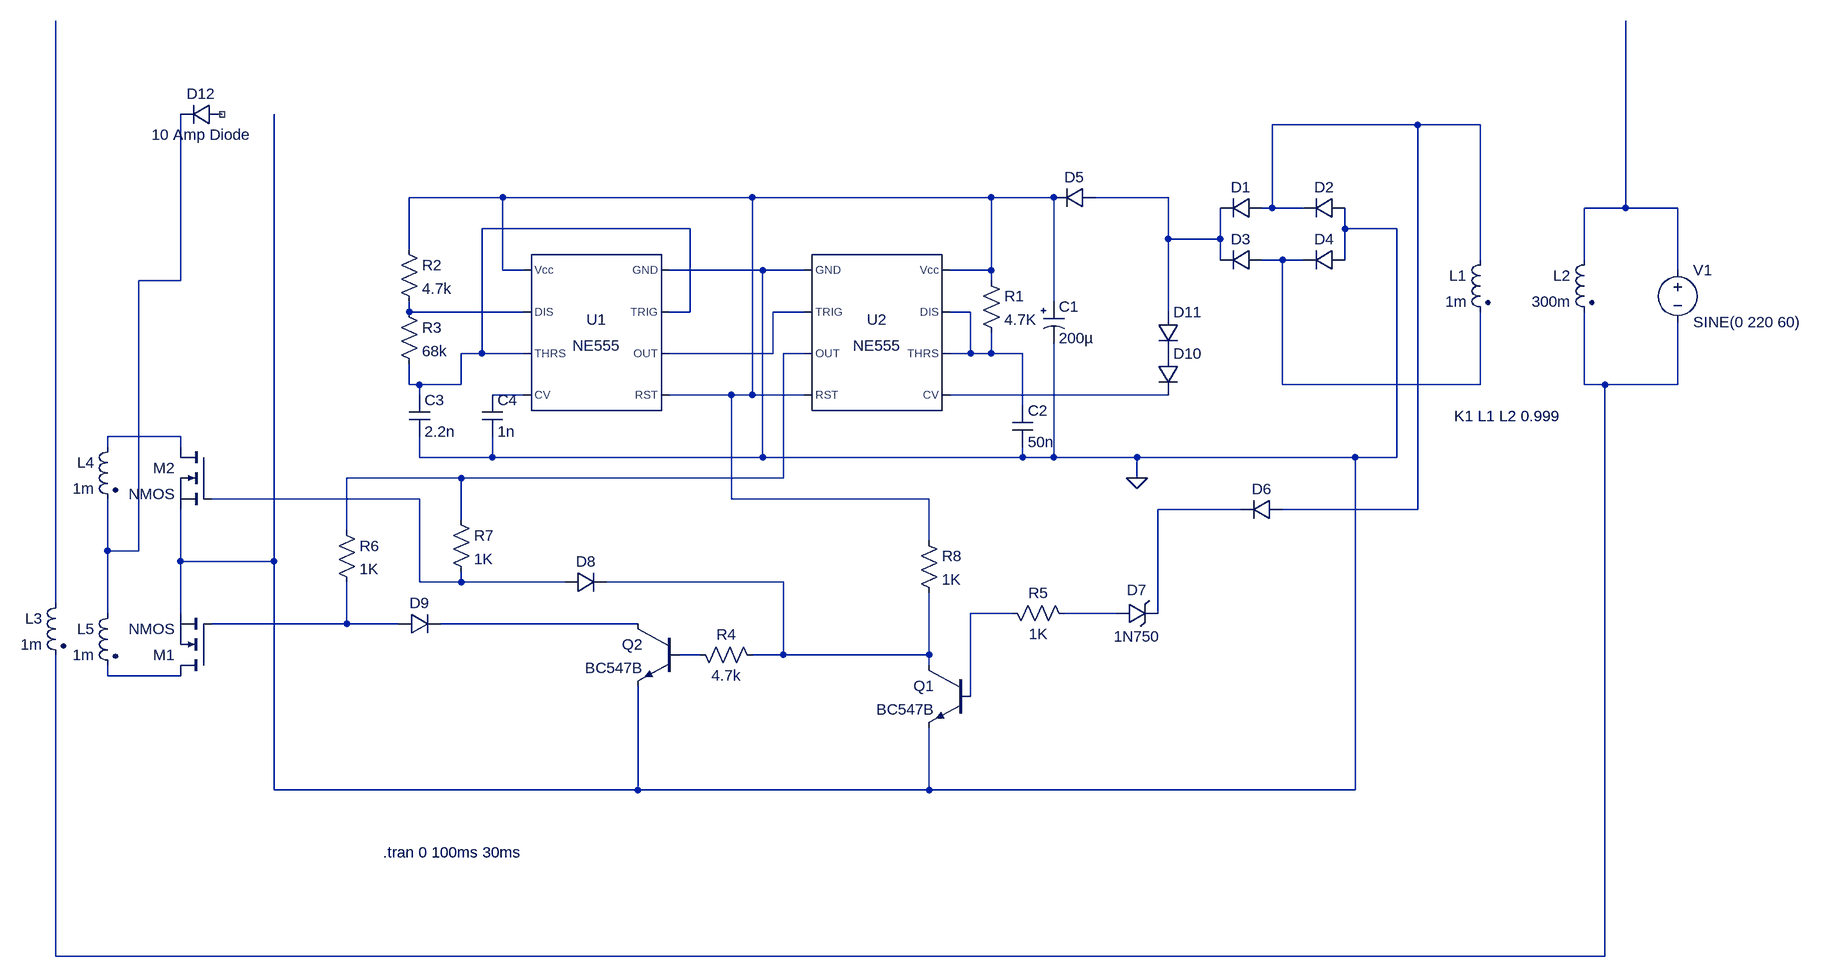
[diagram p0: schematic GridTieInverter.asc]
GridTieInverter.asc, the LTspice schematic file:
Version 4
SHEET 1 2052 1092
WIRE 1264 -192 1040 -192
WIRE 1360 -192 1264 -192
WIRE -144 -80 -288 -80
WIRE 240 -80 -144 -80
WIRE 608 -80 240 -80
WIRE 704 -80 608 -80
WIRE 880 -80 768 -80
WIRE 1040 -64 1040 -192
WIRE 1040 -64 1024 -64
WIRE 1088 -64 1040 -64
WIRE 1584 -64 1584 -352
WIRE 1584 -64 1520 -64
WIRE 1664 -64 1584 -64
WIRE 144 -32 -176 -32
WIRE 1152 -32 1152 -64
WIRE 1232 -32 1152 -32
WIRE 880 -16 880 -80
WIRE 960 -16 960 -64
WIRE 960 -16 880 -16
WIRE -288 0 -288 -80
WIRE 960 16 960 -16
WIRE 1056 16 1024 16
WIRE 1088 16 1056 16
WIRE 1152 16 1152 -32
WIRE 1360 16 1360 -192
WIRE 1520 16 1520 -64
WIRE -144 32 -144 -80
WIRE -112 32 -144 32
WIRE 256 32 112 32
WIRE 320 32 256 32
WIRE 608 32 608 -80
WIRE 608 32 544 32
WIRE 1664 32 1664 -64
WIRE -640 48 -640 -208
WIRE -640 48 -704 48
WIRE 608 48 608 32
WIRE 704 80 704 -80
WIRE -288 96 -288 80
WIRE -112 96 -288 96
WIRE 144 96 144 -32
WIRE 144 96 112 96
WIRE 320 96 272 96
WIRE 576 96 544 96
WIRE 880 96 880 -16
WIRE -176 160 -176 -32
WIRE -176 160 -208 160
WIRE -112 160 -176 160
WIRE 272 160 272 96
WIRE 272 160 112 160
WIRE 320 160 288 160
WIRE 576 160 576 96
WIRE 576 160 544 160
WIRE 608 160 608 128
WIRE 608 160 576 160
WIRE 656 160 608 160
WIRE -288 208 -288 176
WIRE -272 208 -288 208
WIRE -208 208 -208 160
WIRE -208 208 -272 208
WIRE 1056 208 1056 16
WIRE 1360 208 1360 96
WIRE 1360 208 1056 208
WIRE 1520 208 1520 96
WIRE 1552 208 1520 208
WIRE 1664 208 1664 112
WIRE 1664 208 1552 208
WIRE -272 224 -272 208
WIRE -112 224 -160 224
WIRE 208 224 112 224
WIRE 240 224 240 -80
WIRE 240 224 208 224
WIRE 320 224 240 224
WIRE 880 224 544 224
WIRE 656 240 656 160
WIRE -640 288 -752 288
WIRE -752 304 -752 288
WIRE -640 304 -640 288
WIRE -272 320 -272 288
WIRE -160 320 -160 288
WIRE -160 320 -272 320
WIRE 256 320 256 32
WIRE 256 320 -160 320
WIRE 656 320 656 304
WIRE 656 320 256 320
WIRE 704 320 704 144
WIRE 704 320 656 320
WIRE 832 320 704 320
WIRE 1168 320 832 320
WIRE 1232 320 1232 -32
WIRE 1232 320 1168 320
WIRE -208 352 -384 352
WIRE 288 352 288 160
WIRE 288 352 -208 352
WIRE 832 352 832 320
WIRE -272 384 -592 384
WIRE 208 384 208 224
WIRE 512 384 208 384
WIRE 992 400 864 400
WIRE 1264 400 1264 -192
WIRE 1264 400 1056 400
WIRE -208 416 -208 352
WIRE -384 432 -384 352
WIRE 512 448 512 384
WIRE -752 464 -752 384
WIRE -704 464 -704 48
WIRE -704 464 -752 464
WIRE -640 480 -640 400
WIRE -496 480 -496 -208
WIRE -496 480 -640 480
WIRE -272 512 -272 384
WIRE -208 512 -208 496
WIRE -208 512 -272 512
WIRE -48 512 -208 512
WIRE 288 512 16 512
WIRE -832 544 -832 -352
WIRE -752 560 -752 464
WIRE -640 560 -640 480
WIRE 640 560 576 560
WIRE 800 560 720 560
WIRE 864 560 864 400
WIRE -384 576 -384 512
WIRE -384 576 -592 576
WIRE -304 576 -384 576
WIRE 64 576 -240 576
WIRE 160 624 128 624
WIRE 288 624 288 512
WIRE 288 624 240 624
WIRE 512 624 512 528
WIRE 512 624 288 624
WIRE 512 640 512 624
WIRE -752 656 -752 640
WIRE -640 656 -752 656
WIRE 576 688 576 560
WIRE -496 832 -496 480
WIRE 64 832 64 672
WIRE 64 832 -496 832
WIRE 512 832 512 736
WIRE 512 832 64 832
WIRE 1168 832 1168 320
WIRE 1168 832 512 832
WIRE -832 1088 -832 624
WIRE 1552 1088 1552 208
WIRE 1552 1088 -832 1088
FLAG 832 352 0
SYMBOL Misc/NE555 0 128 M0
SYMATTR InstName U1
SYMBOL diode 1024 -80 R90
WINDOW 0 0 32 VBottom 2
WINDOW 3 32 32 Invisible 2
SYMATTR InstName D1
SYMATTR Value 1N4148
SYMBOL diode 1152 -80 R90
WINDOW 0 0 32 VBottom 2
WINDOW 3 32 32 Invisible 2
SYMATTR InstName D2
SYMATTR Value 1N4148
SYMBOL diode 1024 0 R90
WINDOW 0 0 32 VBottom 2
WINDOW 3 32 32 Invisible 2
SYMATTR InstName D3
SYMATTR Value 1N4148
SYMBOL diode 1152 0 R90
WINDOW 0 0 32 VBottom 2
WINDOW 3 32 32 Invisible 2
SYMATTR InstName D4
SYMATTR Value 1N4148
SYMBOL polcap 688 80 R0
SYMATTR InstName C1
SYMATTR Value 200µ
SYMATTR Description Capacitor
SYMATTR Type cap
SYMATTR SpiceLine Rser=180m Lser=0 mfg="   ---" pn="   ---" type="   ---"
SYMBOL cap 640 240 R0
SYMATTR InstName C2
SYMATTR Value 50n
SYMATTR SpiceLine Rser=4m Lser=0 mfg="   ---" pn="   ---" type="   ---"
SYMBOL cap -176 224 R0
SYMATTR InstName C4
SYMATTR Value 1n
SYMATTR SpiceLine Rser=4m Lser=0 mfg="   ---" pn="   ---" type="   ---"
SYMBOL cap -288 224 R0
SYMATTR InstName C3
SYMATTR Value 2.2n
SYMATTR SpiceLine Rser=4m Lser=0 mfg="   ---" pn="   ---" type="   ---"
SYMBOL voltage 1664 16 R0
SYMATTR InstName V1
SYMATTR Value SINE(0 220 60)
SYMBOL res 592 32 R0
SYMATTR InstName R1
SYMATTR Value 4.7K
SYMBOL res -304 -16 R0
SYMATTR InstName R2
SYMATTR Value 4.7k
SYMBOL res -304 80 R0
SYMATTR InstName R3
SYMATTR Value 68k
SYMBOL diode 1056 384 R90
WINDOW 0 0 32 VBottom 2
WINDOW 3 32 32 Invisible 2
SYMATTR InstName D6
SYMATTR Value 1N4148
SYMBOL zener 800 544 M90
WINDOW 0 -4 32 VBottom 2
WINDOW 3 36 32 VTop 2
SYMATTR InstName D7
SYMATTR Value 1N750
SYMATTR Description Diode
SYMATTR Type diode
SYMBOL res 736 576 M270
WINDOW 0 32 56 VTop 2
WINDOW 3 0 56 VBottom 2
SYMATTR InstName R5
SYMATTR Value 1K
SYMBOL npn 576 640 M0
SYMATTR InstName Q1
SYMATTR Value BC547B
SYMBOL npn 128 576 M0
SYMATTR InstName Q2
SYMATTR Value BC547B
SYMBOL res -400 416 R0
SYMATTR InstName R6
SYMATTR Value 1K
SYMBOL res -224 400 R0
SYMATTR InstName R7
SYMATTR Value 1K
SYMBOL diode -48 528 R270
WINDOW 0 32 32 VTop 2
WINDOW 3 0 32 Invisible 2
SYMATTR InstName D8
SYMATTR Value 1N4148
SYMBOL diode -304 592 R270
WINDOW 0 32 32 VTop 2
WINDOW 3 0 32 Invisible 2
SYMATTR InstName D9
SYMATTR Value 1N4148
SYMBOL res 496 432 R0
SYMATTR InstName R8
SYMATTR Value 1K
SYMBOL res 256 640 M270
WINDOW 0 32 56 VTop 2
WINDOW 3 0 56 VBottom 2
SYMATTR InstName R4
SYMATTR Value 4.7k
SYMBOL ind2 1376 0 M0
SYMATTR InstName L1
SYMATTR Value 1m
SYMATTR Type ind
SYMATTR SpiceLine Rser=1m
SYMBOL ind2 1536 0 M0
SYMATTR InstName L2
SYMATTR Value 300m
SYMATTR Type ind
SYMATTR SpiceLine Rser=1m
SYMBOL ind2 -816 528 M0
SYMATTR InstName L3
SYMATTR Value 1m
SYMATTR Type ind
SYMATTR SpiceLine Rser=1m
SYMBOL diode 768 -96 R90
WINDOW 0 0 32 VBottom 2
WINDOW 3 32 32 Invisible 2
SYMATTR InstName D5
SYMATTR Value 1N4148
SYMBOL diode 864 160 R0
WINDOW 3 24 64 Invisible 2
SYMATTR Value 1N4148
SYMATTR InstName D10
SYMBOL diode 864 96 R0
WINDOW 3 24 64 Invisible 2
SYMATTR Value 1N4148
SYMATTR InstName D11
SYMBOL Misc/NE555 432 128 R0
SYMATTR InstName U2
SYMBOL nmos -592 656 R180
SYMATTR InstName M1
SYMBOL nmos -592 304 M0
SYMATTR InstName M2
SYMBOL ind2 -736 288 M0
SYMATTR InstName L4
SYMATTR Value 1m
SYMATTR Type ind
SYMATTR SpiceLine Rser=1m
SYMBOL ind2 -736 544 M0
SYMATTR InstName L5
SYMATTR Value 1m
SYMATTR Type ind
SYMATTR SpiceLine Rser=1m
SYMBOL diode -576 -224 R90
WINDOW 0 0 32 VBottom 2
WINDOW 3 32 32 VTop 2
SYMATTR InstName D12
SYMATTR Value 10 Amp Diode
TEXT -328 928 Left 2 !.tran 0 100ms 30ms
TEXT 1320 256 Left 2 !K1 L1 L2 0.999

The netlist it stands for:
* GridTieInverter.asc
XU1 0 N005 N009 N002 N013 N005 N008 N002 NE555  ; pins GND TRIG OUT RST CV THRS DIS Vcc
D1 N001 N003 1N4148
D2 0 N001 1N4148
D3 N006 N003 1N4148
D4 0 N006 1N4148
C1 N002 0 200µ Rser=180m Lser=0 mfg="   ---" pn="   ---" type="   ---"
C2 N010 0 50n Rser=4m Lser=0 mfg="   ---" pn="   ---" type="   ---"
C4 N013 0 1n Rser=4m Lser=0 mfg="   ---" pn="   ---" type="   ---"
C3 N005 0 2.2n Rser=4m Lser=0 mfg="   ---" pn="   ---" type="   ---"
V1 N004 N012 SINE(0 220 60)
R1 N002 N010 4.7K
R2 N002 N008 4.7k
R3 N008 N005 68k
D6 N001 N017 1N4148
D7 N021 N017 1N750
R5 N021 N020 1K
Q1 N018 N020 0 0 BC547B
Q2 N023 N024 0 0 BC547B
R6 N011 N022 1K
R7 N011 N016 1K
D8 N016 N018 1N4148
D9 N022 N023 1N4148
R8 N002 N018 1K
R4 N018 N024 4.7k
L1 N001 N006 1m Rser=1m
L2 N004 N012 300m Rser=1m
L3 N019 N012 1m Rser=1m
D5 N003 N002 1N4148
D10 P001 N014 1N4148
D11 N003 P001 1N4148
XU2 0 N009 N011 N002 N014 N010 N010 N002 NE555  ; pins GND TRIG OUT RST CV THRS DIS Vcc
M1 N025 N022 0 0 NMOS
M2 N015 N016 0 0 NMOS
L4 N015 N007 1m Rser=1m
L5 N007 N025 1m Rser=1m
D12 NC_01 N007 10 Amp Diode
.model D D
.lib standard.dio
.model NPN NPN
.model PNP PNP
.lib standard.bjt
.model NMOS NMOS
.model PMOS PMOS
.lib standard.mos
.tran 0 100ms 30ms
K1 L1 L2 0.999
.lib NE555.sub
.backanno
.end